# EAGLE schematic untitled (EAGLE 9.5.0)
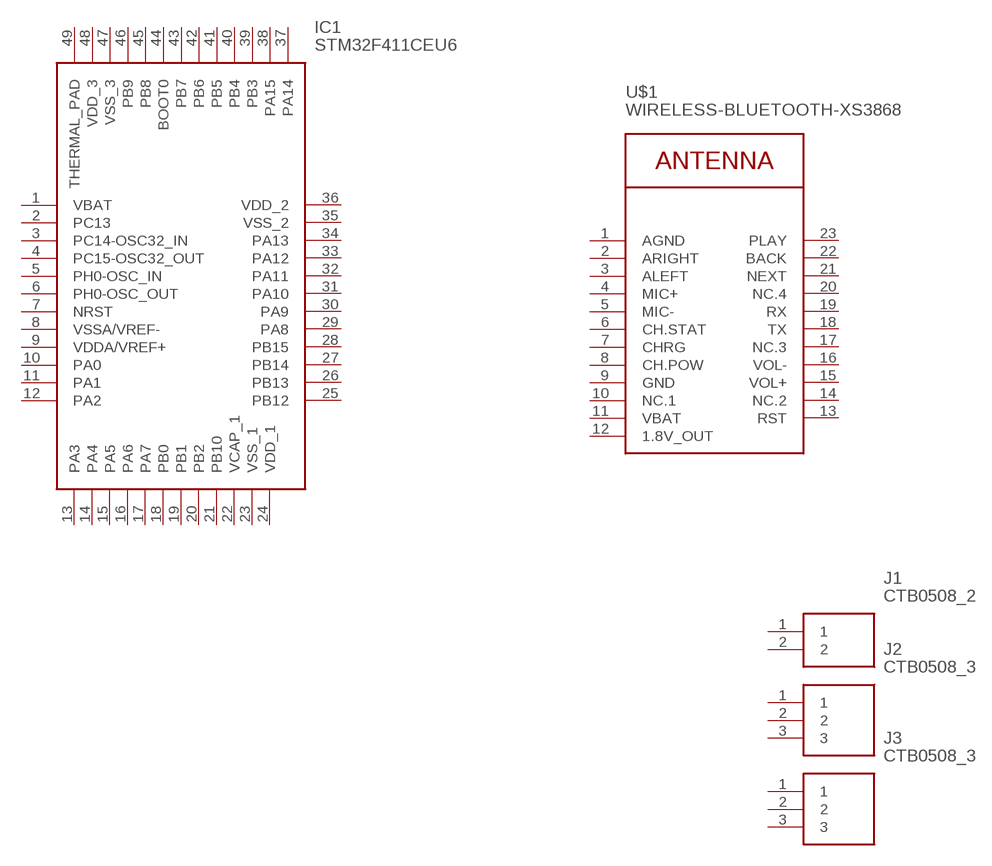
[diagram p0: schematic, sheet 1]

## Parts
IC1  STM32F411CEU6  [QFN50P700X700X60-49N]
J1  CTB0508_2  [SHDR2W100P0X508_1X2_1020X810X1]
J2  CTB0508_3  [SHDR3W100P0X508_1X3_1520X810X1]
J3  CTB0508_3  [SHDR3W100P0X508_1X3_1520X810X1]
U$1  WIRELESS-BLUETOOTH-XS3868  [WIRELESS-BLUETOOTH-XS3868]
Unconnected: IC1.1(VBAT) IC1.2(PC13) IC1.3(PC14-OSC32_IN) IC1.4(PC15-OSC32_OUT) IC1.5(PH0-OSC_IN) IC1.6(PH0-OSC_OUT) IC1.7(NRST) IC1.8(VSSA/VREF-) IC1.9(VDDA/VREF+) IC1.10(PA0) IC1.11(PA1) IC1.12(PA2) IC1.13(PA3) IC1.14(PA4) IC1.15(PA5) IC1.16(PA6) IC1.17(PA7) IC1.18(PB0) IC1.19(PB1) IC1.20(PB2) IC1.21(PB10) IC1.22(VCAP_1) IC1.23(VSS_1) IC1.24(VDD_1) IC1.25(PB12) IC1.26(PB13) IC1.27(PB14) IC1.28(PB15) IC1.29(PA8) IC1.30(PA9) IC1.31(PA10) IC1.32(PA11) IC1.33(PA12) IC1.34(PA13) IC1.35(VSS_2) IC1.36(VDD_2) IC1.37(PA14) IC1.38(PA15) IC1.39(PB3) IC1.40(PB4) IC1.41(PB5) IC1.42(PB6) IC1.43(PB7) IC1.44(BOOT0) IC1.45(PB8) IC1.46(PB9) IC1.47(VSS_3) IC1.48(VDD_3) IC1.49(THERMAL_PAD) J1.1 J1.2 U$1.2(ARIGHT) U$1.3(ALEFT) U$1.4(MIC+) U$1.5(MIC-) U$1.6(CH.STAT) U$1.7(CHRG) U$1.8(CH.POW) U$1.10(NC.1) U$1.14(NC.2) U$1.15(VOL+) U$1.16(VOL-) U$1.17(NC.3) U$1.18(TX) U$1.19(RX) U$1.20(NC.4) U$1.21(NEXT) U$1.22(BACK) U$1.23(PLAY)

## Power pins joined to a net without a drawn wire
1: J2.1 J3.1
1.8V_OUT: U$1.12(1.8V_OUT)
2: J2.2 J3.2
3: J2.3 J3.3
AGND: U$1.1(AGND)
GND: U$1.9(GND)
RST: U$1.13(RST)
VBAT: U$1.11(VBAT)

## Library data of the parts
IC1 = STM32F411CEU6:STM32F411CEU6: 32-Bit MCU 512K Flash 100MHz UFQFPN48 STMicroelectronics STM32F411CEU6, 32bit ARM Cortex M4 MCU, 100MHz, 512 kB Flash, 48-Pin UFQFPN Source: Datasheet <http://www.st.com/content/ccc/resource/technical/document/datasheet/b3/a5/46/3b/b4/e5/4c/85/DM00115249.pdf/files/DM00115249.pdf/jcr:content/translations/en.DM00115249.pdf>; DESCRIPTION: 32-Bit MCU 512K Flash 100MHz UFQFPN48 STMicroelectronics STM32F411CEU6, 32bit ARM Cortex M4 MCU, 100MHz, 512 kB Flash, 48-Pin UFQFPN; HEIGHT: 0.6mm; MANUFACTURER_NAME: STMicroelectronics; MANUFACTURER_PART_NUMBER: STM32F411CEU6; MOUSER_PART_NUMBER: 511-STM32F411CEU6; MOUSER_PRICE-STOCK: https://www.mouser.com/Search/Refine.aspx?Keyword=511-STM32F411CEU6; RS_PART_NUMBER: 1106616P; RS_PRICE-STOCK: http://uk.rs-online.com/web/p/products/1106616P
J1 = CTB0508_2:CTB0508_2: CAMDENBOSS - CTB0508/2 - TERMINAL BLOCK, WIRE TO BRD, 2POS, 14AWG Source: Datasheet <http://www.farnell.com/datasheets/1702335.pdf>; DESCRIPTION: CAMDENBOSS - CTB0508/2 - TERMINAL BLOCK, WIRE TO BRD, 2POS, 14AWG; HEIGHT: 10mm; MANUFACTURER_NAME: CAMDENBOSS; MANUFACTURER_PART_NUMBER: CTB0508/2
J2 J3 = CTB0508_3:CTB0508_3: CAMDENBOSS - CTB0508/3 - TERMINAL BLOCK, WIRE TO BRD, 3POS, 14AWG Source: Datasheet <https://componentsearchengine.com/Datasheets/2/CTB0508_3.pdf>; DESCRIPTION: CAMDENBOSS - CTB0508/3 - TERMINAL BLOCK, WIRE TO BRD, 3POS, 14AWG; HEIGHT: 10mm; MANUFACTURER_NAME: CAMDENBOSS; MANUFACTURER_PART_NUMBER: CTB0508/3
U$1 = XS3868OVC3860:WIRELESS-BLUETOOTH-XS3868: Bluetooth Stereo Audio Module based on OVC3860 chip More details available here: http://artofcircuits.com/product/bluetooth-2-0-edr-stereo-audio-ovc3860-module-model-xs-3868 Click here to find device on ebay.com <http://www.ebay.com/sch/xs3868+bluetooth+audio+module>